# EAGLE design schematic (EAGLE 6.5.0)
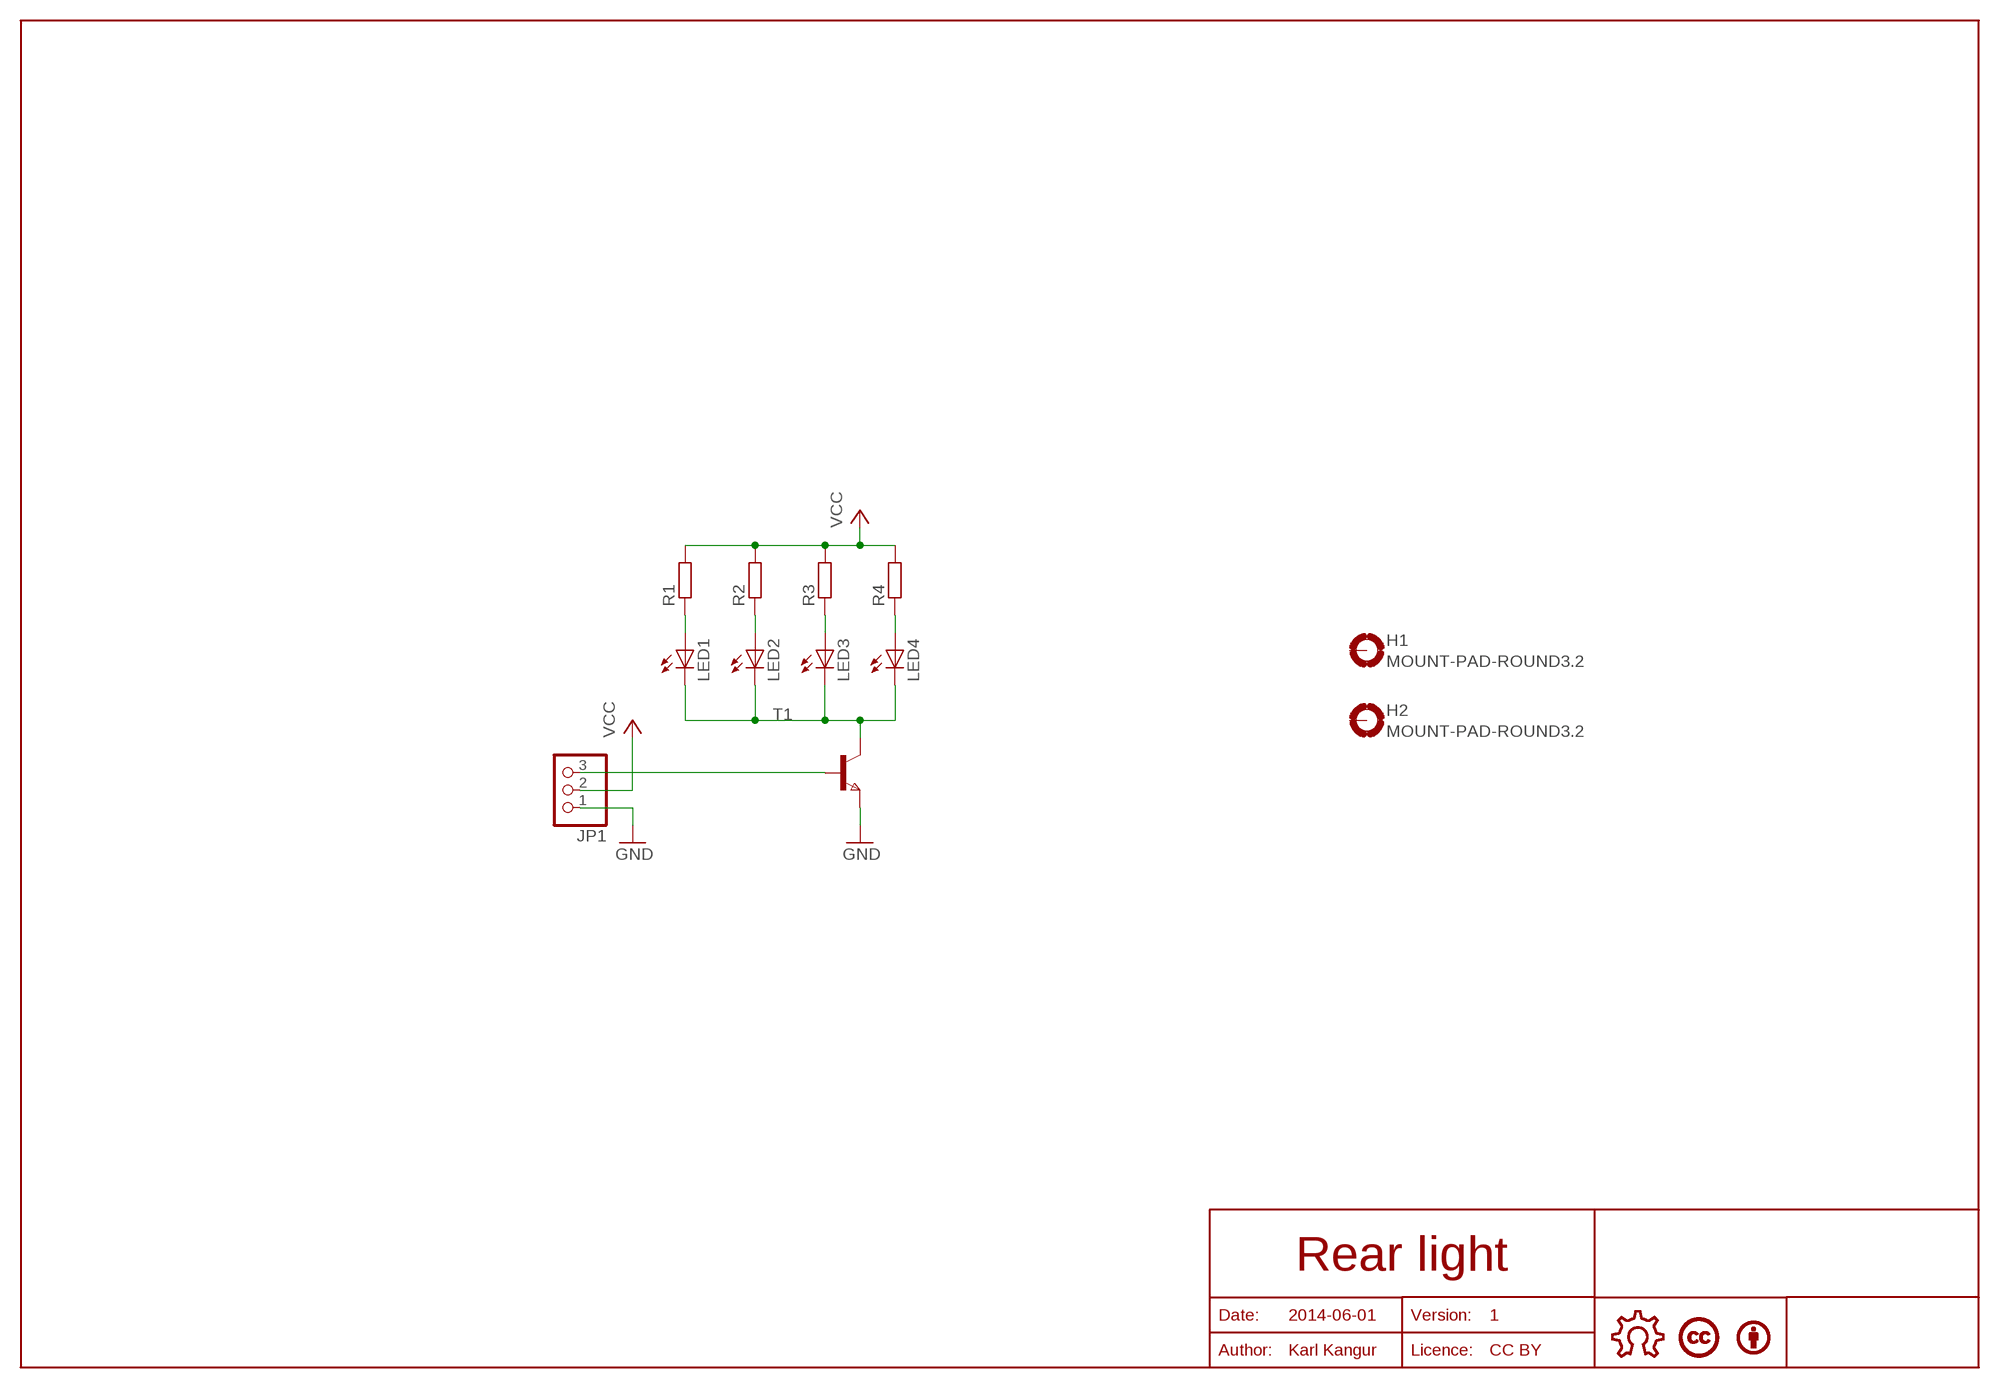
[diagram p0: schematic, sheet 1]

## Parts
BY1  BYBOTTOM  [BY]
H1  MOUNT-PAD-ROUND3.2  [3,2-PAD]
H2  MOUNT-PAD-ROUND3.2  [3,2-PAD]
JP1  PINHD-1X3  [1X03]
LED1  LED3MM  [LED3MM]
LED2  LED3MM  [LED3MM]
LED3  LED3MM  [LED3MM]
LED4  LED3MM  [LED3MM]
LICENCE1  LICENCECC-BOTTOM  [CREATIVE-COMMONS]
R1  R-EU_R0805  [R0805]
R2  R-EU_R0805  [R0805]
R3  R-EU_R0805  [R0805]
R4  R-EU_R0805  [R0805]
T1  NPNSOT323  [SOT323]
U$10  OPEN-HARDWARE-LOGOBOTTOM-SMALL  [OPEN-HARDWARE-BOTTOM-SMALL]

## Nets
GND: JP1.1 T1.3(E)
N$1: JP1.3 T1.2(B)
N$2: LED1.K(C) LED2.K(C) LED3.K(C) LED4.K(C) T1.1(C)
N$3: LED1.A R1.1
N$4: LED2.A R2.1
N$5: LED3.A R3.1
N$6: LED4.A R4.1
VCC: JP1.2 R1.2 R2.2 R3.2 R4.2
Unconnected: H1.B3,2(MOUNT) H2.B3,2(MOUNT)

## Notes on the sheet
- Rear light
- Date: | 2014-06-01 | Version: | 1
- Author: | Karl Kangur | Licence: | CC BY

## Library data of the parts
BY1 = robopoly:BY
H1 H2 = robopoly:MOUNT-PAD-ROUND: MOUNTING PAD, round
JP1 = pinhead:PINHD-1X3: PIN HEADER
LED1-LED4 = led:LED: LED OSRAM: - CHIPLED LG R971, LG N971, LY N971, LG Q971, LY Q971, LO R971, LY R971 LH N974, LH R974 LS Q976, LO Q976, LY Q976 LO Q996 - Hyper CHIPLED LW Q18S LB Q993, LB Q99A, LB R99A - SideLED LS A670, LO A670, LY A670, LG A670, LP A670 LB A673, LV A673, LT A673, LW A673 LH A674 LY A675 LS A676, LA A676, LO A676, LY A676, LW A676 LS A679, LY A679, LG A679 - Hyper Micro SIDELED® LS Y876, LA Y876, LO Y876, LY Y876 LT Y87S - SmartLED LW L88C, LW L88S LB L89C, LB L89S, LG L890 LS L89K, LO L89K, LY L89K LS L896, LA L896, LO L896, LY L896 - TOPLED LS T670, LO T670, LY T670, LG T670, LP T670 LSG T670, LSP T670, LSY T670, LOP T670, LYG T670 LG T671, LOG T671, LSG T671 LB T673, LV T673, LT T673, LW T673 LH T674 LS T676, LA T676, LO T676, LY T676, LB T676, LH T676, LSB T676, LW T676 LB T67C, LV T67C, LT T67C, LS T67K, LO T67K, LY T67K, LW E67C LS E67B, LA E67B, LO E67B, LY E67B, LB E67C, LV E67C, LT E67C LW T67C LS T679, LY T679, LG T679 LS T770, LO T770, LY T770, LG T770, LP T770 LB T773, LV T773, LT T773, LW T773 LH T774 LS E675, LA E675, LY E675, LS T675 LS T776, LA T776, LO T776, LY T776, LB T776 LHGB T686 LT T68C, LB T68C - Hyper Mini TOPLED® LB M676 - Mini TOPLED Santana® LG M470 LS M47K, LO M47K, LY M47K Source: http://www.osram.convergy.de LUXEON: - LUMILED® LXK2-PW12-R00, LXK2-PW12-S00, LXK2-PW14-U00, LXK2-PW14-V00 LXK2-PM12-R00, LXK2-PM12-S00, LXK2-PM14-U00 LXK2-PE12-Q00, LXK2-PE12-R00, LXK2-PE12-S00, LXK2-PE14-T00, LXK2-PE14-U00 LXK2-PB12-K00, LXK2-PB12-L00, LXK2-PB12-M00, LXK2-PB14-N00, LXK2-PB14-P00, LXK2-PB14-Q00 LXK2-PR12-L00, LXK2-PR12-M00, LXK2-PR14-Q00, LXK2-PR14-R00 LXK2-PD12-Q00, LXK2-PD12-R00, LXK2-PD12-S00 LXK2-PH12-R00, LXK2-PH12-S00 LXK2-PL12-P00, LXK2-PL12-Q00, LXK2-PL12-R00 Source: www.luxeon.com KINGBRIGHT: KA-3528ASYC Source: www.kingbright.com
LICENCE1 = robopoly:LICENCE
R1-R4 = rcl:R-EU_: RESISTOR, European symbol
T1 = zetex:NPNSOT323: NPN TRANSISTOR; MPN: DSS4160U-7; OC_FARNELL: 1710696; OC_NEWARK: 25R4558
U$10 = robopoly:OPEN-HARDWARE-LOGO

## Board
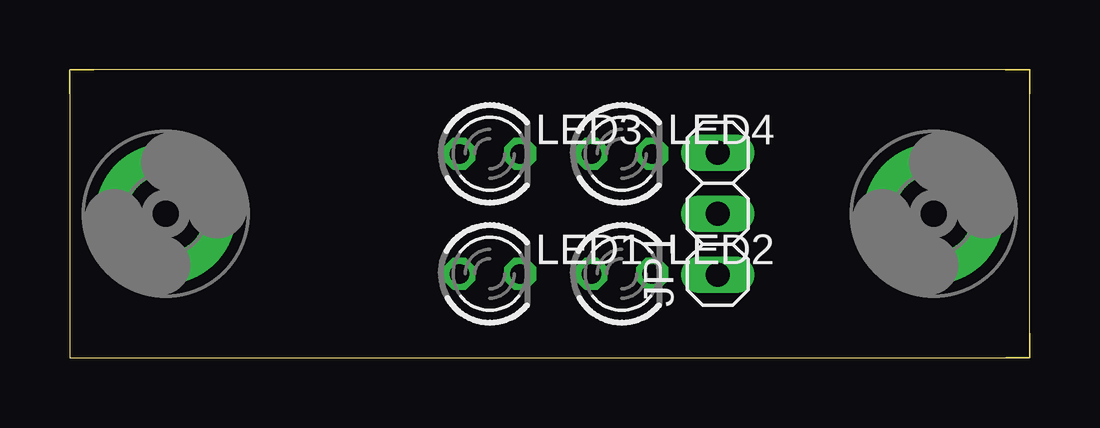
[diagram p1: board, top side]
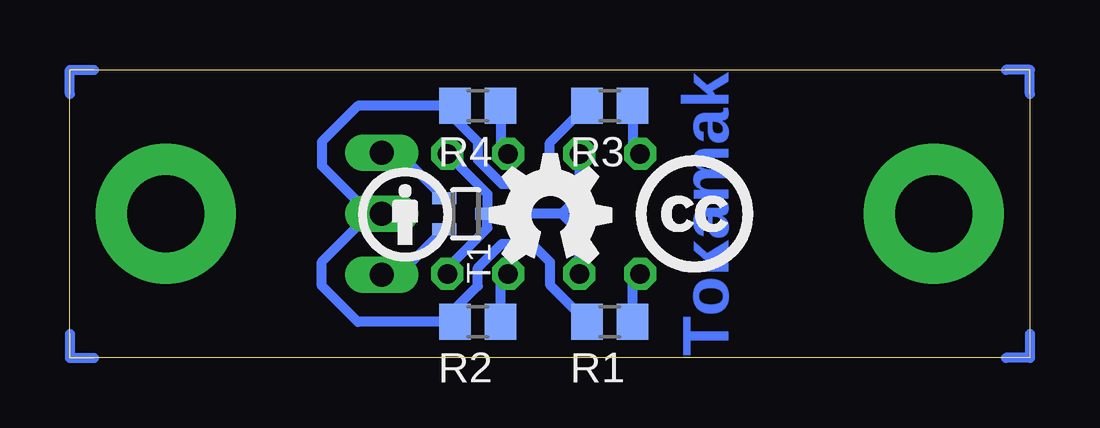
[diagram p2: board, bottom side, seen from below]

Size 40 x 12 mm. Coordinates in mm from the lower left corner, seen from the top.
Outline: 0,0 40,0 40,12 0,12 0,0
Copper layers (1*16): Top 0.035mm / dielectric 1.5mm / Bottom 0.035mm
Design rules "default": minimum track width 10mil, minimum drill 24mil, track to track 8mil, track to pad 8mil, pad to pad 8mil, via to via 8mil, smd to smd 8mil, copper to edge 40mil, drill to drill 8mil, minimum pad ring 10mil, minimum via ring 8mil, stop-mask expansion 4mil, vias tented up to drill 0mil, thermal gap 10mil

### Footprints (pad centres in the part's own frame; a part is rotated, then mirrored left to right if it is on the bottom)
3,2-PAD = drill 3.2 pad 5.842: B3,2 0,0
1X03 = drill 1.016 long: 1 -2.54,0; 2 0,0; 3 2.54,0
LED3MM = drill 0.813 octagon: A -1.27,0; K 1.27,0
R0805 = smd 1.3 x 1.5: 1 -0.95,0; 2 0.95,0
SOT323 = smd 0.5 x 1: 1 0,0.9; 2 -0.65,-0.9; 3 0.65,-0.9

### Placement (x,y rotation side)
BY1  26,6 0 top
H1  4,6 0 top
H2  36,6 0 top
JP1  27,6 90 top
LED1  17.5,3.5 0 top
LED2  23,3.5 0 top
LED3  17.5,8.5 0 top
LED4  23,8.5 0 top
LICENCE1  14,6 0 top
R1  17.5,1.5 180 bottom
R2  23,1.5 180 bottom
R3  17.5,10.5 180 bottom
R4  23,10.5 180 bottom
T1  23.5,6 270 bottom
U$10  20,6 0 top

### Tracks (layer width: path | path; a pad name or v marks a point on that pad's centre or on a via)
GND
  Bottom 0.406: T1.3 26.29,3.46 JP1.1
N$1
  Bottom 0.406: T1.2 26.29,8.54 JP1.3
N$2
  Bottom 0.406: LED1.K 18.77,5.27 19.5,6 | 19.5,6 T1.1 | LED3.K 18.77,6.73 19.5,6 | LED2.K 24.27,3.73 22.6,5.4 T1.1 | LED4.K 22.6,6.83 T1.1
N$3
  Bottom 0.406: R1.1 16.55,3.18 LED1.A
N$4
  Bottom 0.406: R2.1 22.05,3.18 LED2.A
N$5
  Bottom 0.406: R3.1 16.55,8.82 LED3.A
N$6
  Bottom 0.406: R4.1 22.05,8.82 LED4.A
N$7
  Bottom 0.406: 0,11 0,12 1,12
N$8
  Bottom 0.406: 40,11 40,12 39,12
N$9
  Bottom 0.406: 40,1 40,0 39,0
N$10
  Bottom 0.406: 0,1 0,0 1,0
N$11  (2 unrouted)
N$12  (2 unrouted)
N$13  (2 unrouted)
N$14  (2 unrouted)
VCC
  Bottom 0.406: 27.5,6 29.5,4 29.5,3 28,1.5 R2.2 23.95,2.05 23,3 23,3.75 22,4.75 20.75,4.75 20,4 20,3.05 R1.2 | 27.5,6 29.5,8 29.5,9 28,10.5 R4.2 23.95,9.95 23,9 23,8.25 22,7.25 20.75,7.25 20,8 20,8.95 R3.2 | 27.5,6 JP1.2

### Text on the board
Bottom: Tokamak